# EAGLE design schema (EAGLE 8.2.1)
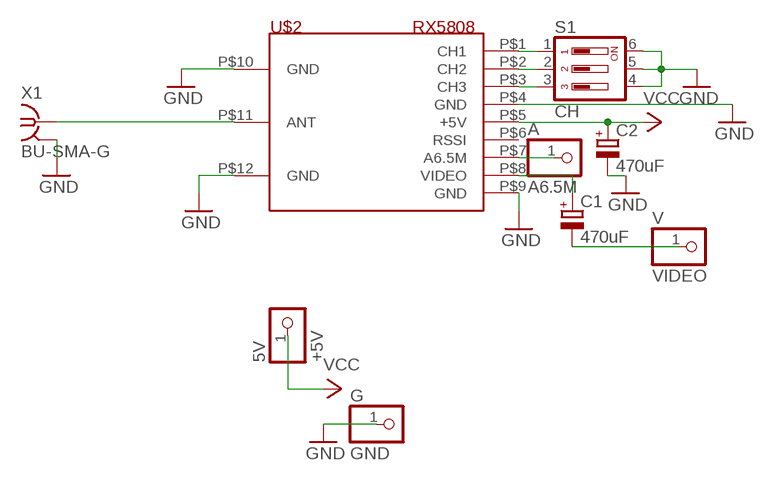
[diagram p0: schematic, sheet 1]

## Parts
5V  +5V  PINHD-1X1  [1X01]
A  A6.5M  PINHD-1X1  [1X01]
C1  470uF  CPOL-EUE3.5-8  [E3,5-8]
C2  470uF  CPOL-EUE3.5-8  [E3,5-8]
G  GND  PINHD-1X1  [1X01]
S1  CH  DS03  [DS-03]
U$2  RX5808  [RX5808]
V  VIDEO  PINHD-1X1  [1X01]
X1  BU-SMA-G  [BU-SMA-G]

## Nets
ANTENA: U$2.P$11(ANT) X1.1
AUDIO: A.1 U$2.P$7(A6.5M)
CH1: S1.1 U$2.P$1(CH1)
CH2: S1.2 U$2.P$2(CH2)
CH3: S1.3 U$2.P$3(CH3)
GND: C2.- G.1 S1.4 S1.5 S1.6 U$2.P$4(GND) U$2.P$9(GND) U$2.P$10(GND) U$2.P$12(GND) X1.2 X1.3 X1.4 X1.5
VCC: 5V.1 C2.+ U$2.P$5(+5V)
VIDEO_IN: C1.+ U$2.P$8(VIDEO)
VIDEO_OUT: C1.- V.1
Unconnected: U$2.P$6(RSSI)

## Library data of the parts
5V A G V = pinhead:PINHD-1X1: PIN HEADER
C1 C2 = resistor:CPOL-EU: POLARIZED CAPACITOR, European symbol
S1 = switch-dil:DS03: DIL/CODE SWITCH; OC_FARNELL: 1255223; OC_NEWARK: unknown
U$2 = custom-parts:RX5808: Boscam FPV 5.8G Wireless Audio Video Receiving Module RX5808 Specification: Brand Name: Boscam Item Name: RX5808 Receiving Module Receiver Frequency: 5645-5945MHz; 8channels Receiving Sensitivity: -90dBm Frequency Control: built-in frequency and phase lock loop AV Output : analog AV signal output Power Supply voltage: 3.5V Supply Current: 170mA Dimension: 28 x 23 x 3mm
X1 = con-coax:BU-SMA-G: FEMALE SMA CONNECTOR Radiall distributor RS 193-9117; OC_FARNELL: unknown; OC_NEWARK: unknown

## Board
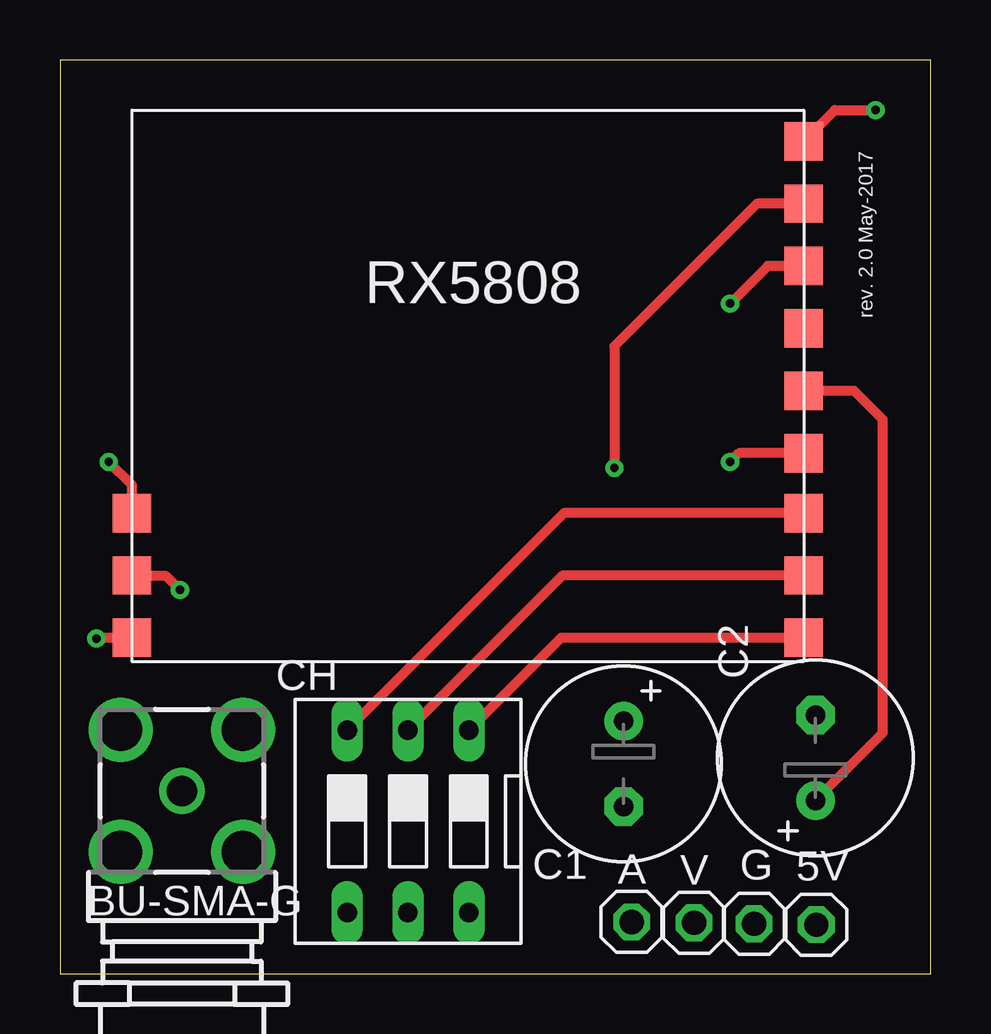
[diagram p1: board, top side]
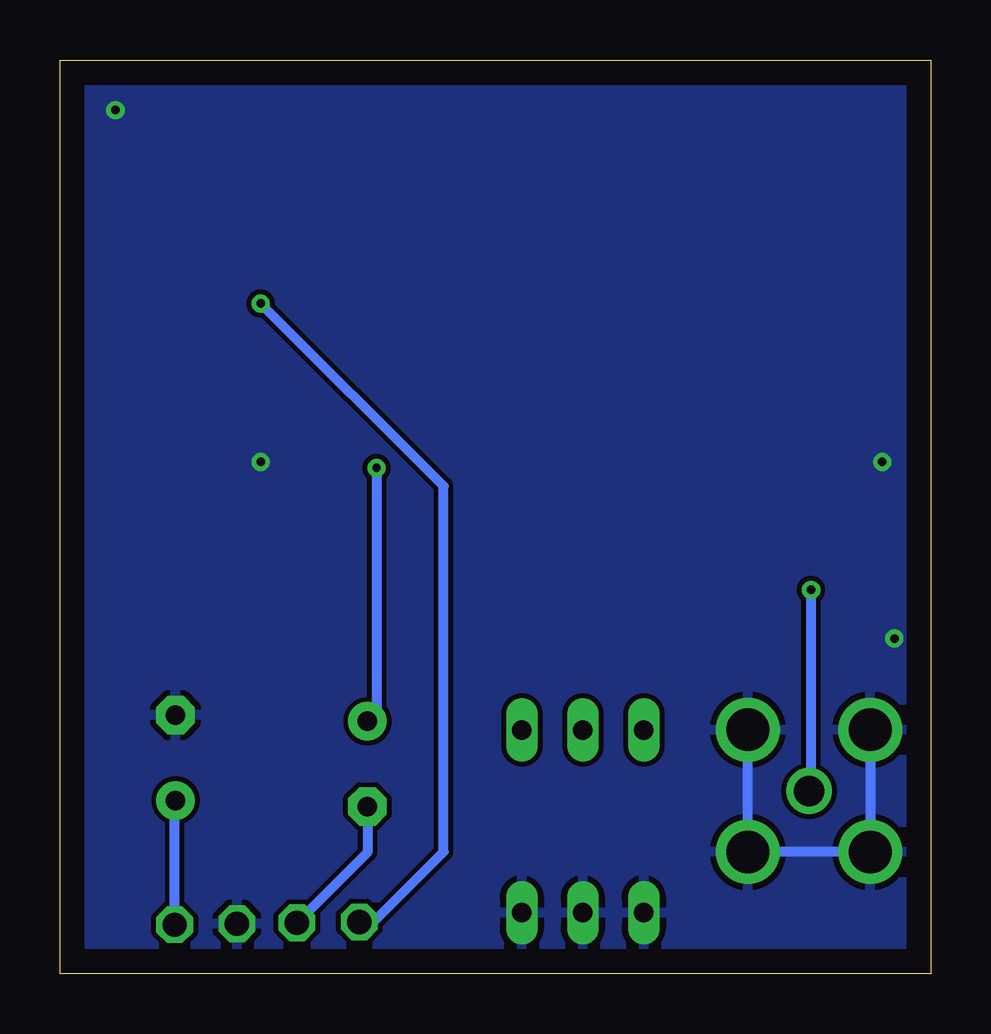
[diagram p2: board, bottom side, seen from below]

Size 36.31 x 38.09 mm. Coordinates in mm from the lower left corner, seen from the top.
Outline: 0,0 36.31,0 36.31,38.09 0,38.09 0,0
Copper layers (1*16): Top 0.035mm / dielectric 1.5mm / Bottom 0.035mm
Design rules "default *": minimum track width 10mil, minimum drill 13mil, track to track 8mil, track to pad 8mil, pad to pad 8mil, via to via 8mil, smd to smd 8mil, copper to edge 40mil, drill to drill 8mil, minimum pad ring 10mil, minimum via ring 8mil, stop-mask expansion 4mil, vias tented up to drill 14mil, thermal gap 10mil

### Footprints (pad centres in the part's own frame; a part is rotated, then mirrored left to right if it is on the bottom)
1X01 = drill 1.016 octagon: 1 0,0
E3,5-8 = drill 0.813 pad 1.6: + -1.778,0 | drill 0.813 pad 1.6 octagon: - 1.778,0
DS-03 = drill 0.813 long: 1 -2.54,-3.81; 2 0,-3.81; 3 2.54,-3.81; 4 2.54,3.81; 5 0,3.81; 6 -2.54,3.81
RX5808 = smd 1.6 x 1.6: P$1 14,-11; P$2 14,-8.4; P$3 14,-5.8; P$4 14,-3.3; P$5 14,-0.7; P$6 14,1.9; P$7 14,4.5; P$8 14,7.1; P$9 14,9.7; P$10 -14,-11; P$11 -14,-8.4; P$12 -14,-5.8
BU-SMA-G = drill 1.27: 1 0,0 | drill 1.778: 2 -2.55,2.55; 3 2.55,2.55; 4 2.55,-2.55; 5 -2.55,-2.55

### Placement (x,y rotation side)
5V  31.53,2.04 0 top
A  23.83,2.16 0 top
C1  23.49,8.75 270 top
C2  31.49,9 90 top
G  28.93,2.08 0 top
S1  14.51,6.35 180 top
U$2  17,25 0 top
V  26.43,2.12 0 top
X1  5.08,7.62 270 top

### Tracks (layer width: path | path; a pad name or v marks a point on that pad's centre or on a via)
ANTENA  (via drill 0.35)
  Top 0.406: U$2.P$11 4.4,16.6 v5,16
  Bottom 0.406: v5,16 5,7.7 X1.1
AUDIO  (via drill 0.35)
  Top 0.406: U$2.P$7 29.5,29.5 v27.94,27.94
  Bottom 0.406: v27.94,27.94 20.32,20.32 20.32,5.08 23.24,2.16 A.1
CH1
  Top 0.406: U$2.P$1 20.89,14 S1.1
CH2
  Top 0.406: U$2.P$2 20.95,16.6 S1.2
CH3
  Top 0.406: U$2.P$3 21.01,19.2 S1.3
GND  (via drill 0.35)
  Top 0.406: U$2.P$9 32.3,36 v34,36 | U$2.P$12 3,20.37 v2.03,21.34 | U$2.P$10 1.55,14 v1.52,13.97 | U$2.P$4 28.3,21.7 v27.94,21.34
  Bottom 0.406: X1.5 X1.4 X1.3 X1.2
  pour Bottom: 0,38.1 36.64,38.1 36.64,0 0,0
VCC
  Top 0.406: U$2.P$5 33.1,24.3 34.29,23.11 34.29,10.02 C2.+
  Bottom 0.406: 5V.1 31.53,7.18 C2.+
VIDEO_IN  (via drill 0.35)
  Top 0.406: 31.14,32.24 U$2.P$8 29.05,32.1 23.11,26.16 v23.11,21.08
  Bottom 0.406: v23.11,21.08 23.11,10.9 C1.+
VIDEO_OUT
  Bottom 0.406: C1.- 23.49,5.06 V.1

### Text on the board
tNames: rev. 2.0 May-2017 | RX5808